# EAGLE design arduino_mini_can_bus (EAGLE 7.5.0)
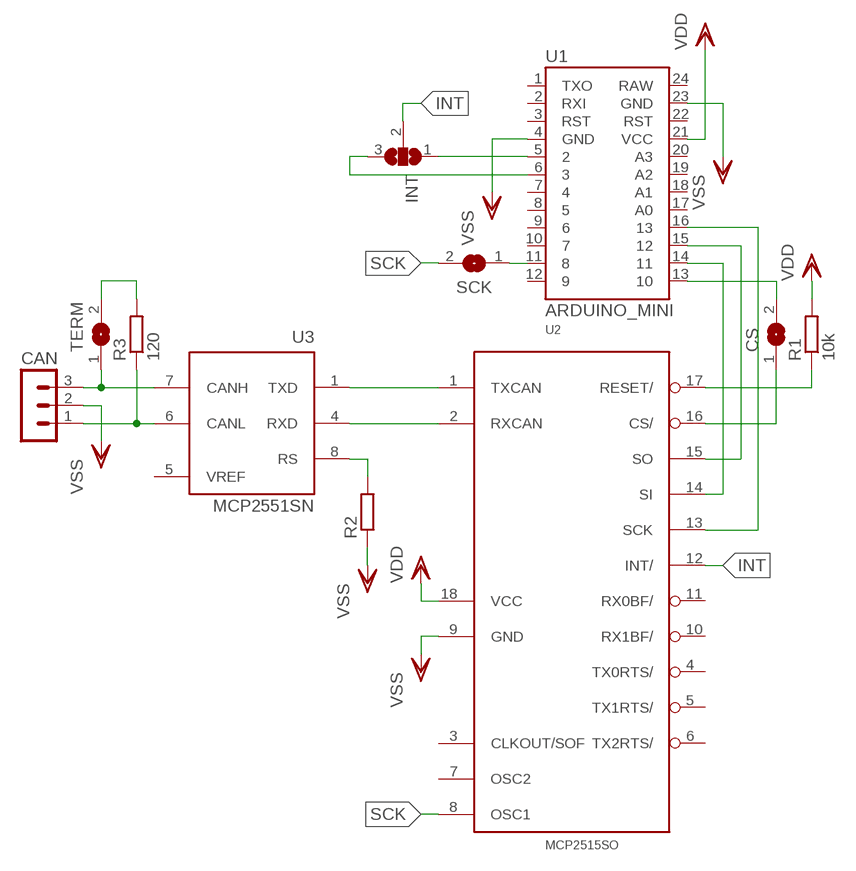
[diagram p0: schematic, sheet 1]

## Parts
CAN  MA03-1  [MA03-1]
CS  SJ  [SJ]
INT  SJ2W  [SJ_2]
R1  10k  R-EU_0207/10  [0207/10]
R2  R-EU_0207/10  [0207/10]
R3  120  R-EU_0207/10  [0207/10]
SCK  SJ  [SJ]
TERM  SJ  [SJ]
U1  ARDUINO_MINI  [ARDUINO_MINI]
U2  MCP2515SO  [SO18L]
U3  MCP2551SN  [SO-08]

## Nets
INT: INT.2 U2.12(INT/)
N$1: U1.14 U2.14(SI)
N$2: U1.15 U2.15(SO)
N$3: U1.16 U2.13(SCK)
N$4: CS.1 U2.16(CS/)
N$5: CS.2 U1.13
N$6: U2.1(TXCAN) U3.1(TXD)
N$7: U2.2(RXCAN) U3.4(RXD)
N$8: CAN.1 R3.1 U3.6(CANL)
N$9: CAN.3 TERM.1 U3.7(CANH)
N$10: SCK.1 U1.11
N$11: INT.1 U1.5
N$12: R3.2 TERM.2
N$13: R1.1 U2.17(RESET/)
N$14: R2.2 U3.8(RS)
N$15: INT.3 U1.6
SCK: SCK.2 U2.8(OSC1)
VDD: R1.2 U1.21(VCC) U2.18(VCC)
VSS: CAN.2 R2.1 U1.4(GND) U1.23(GND) U2.9(GND)
Unconnected: U1.1(TXO) U1.2(RXI) U1.3(RST) U1.7 U1.8 U1.9 U1.10 U1.12 U1.17(A0) U1.18(A1) U1.19(A2) U1.20(A3) U1.22(RST) U1.24(RAW) U2.3(CLKOUT/SOF) U2.4(TX0RTS/) U2.5(TX1RTS/) U2.6(TX2RTS/) U2.7(OSC2) U2.10(RX1BF/) U2.11(RX0BF/)

## Power pins joined to a net without a drawn wire
VDD: U3.3(VDD)
VREF: U3.5(VREF)
VSS: U3.2(VSS)

## Library data of the parts
CAN = con-lstb:MA03-1: PIN HEADER; OC_FARNELL: unknown; OC_NEWARK: unknown
CS SCK TERM = jumper:SJ: SMD solder JUMPER
INT = jumper:SJ2W: SMD solder JUMPER
R1-R3 = rcl:R-EU_: RESISTOR, European symbol
U1 = SparkFun-Boards:ARDUINO_MINI: Arduino Pro Mini footprint
U2 = MCP2515_MT:MCP2515*: MCP2515 Standalone CAN-Controller by Microchip Eagle-Lib. by MartinThomas
U3 = microchip_can:MCP2551: High Speed CAN tranceiver

## Board
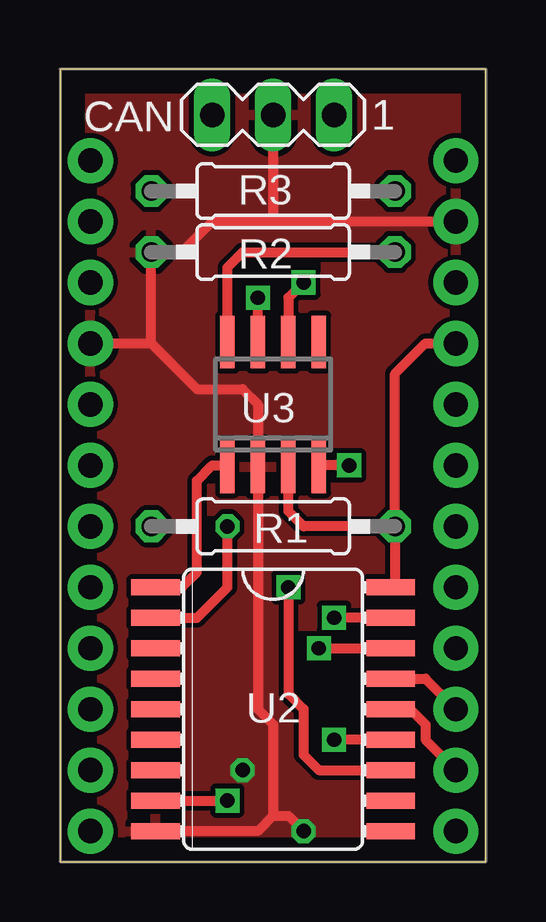
[diagram p1: board, top side]
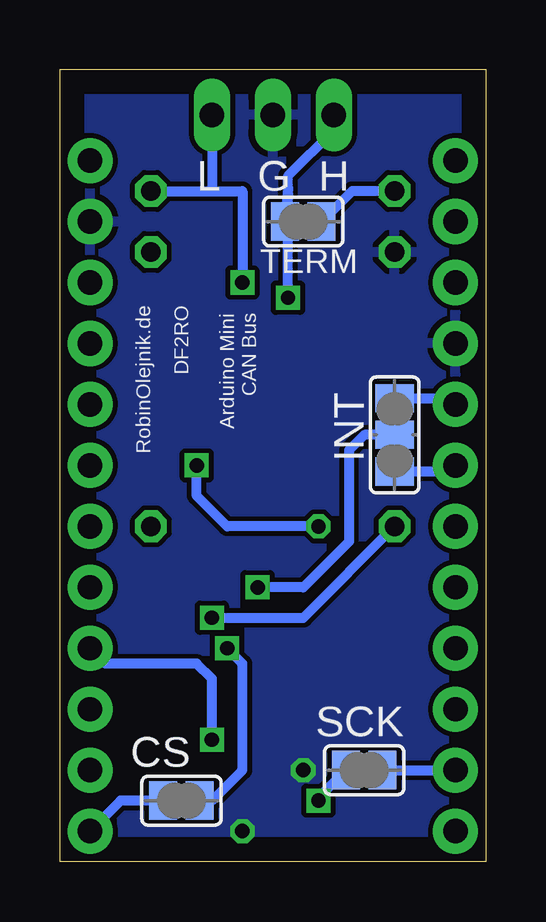
[diagram p2: board, bottom side, seen from below]

Size 17.77 x 33.01 mm. Coordinates in mm from the lower left corner, seen from the top.
Outline: 0,0 17.77,0 17.77,33.01 0,33.01 0,0
Copper layers (1*16): Top 0.035mm / dielectric 1.5mm / Bottom 0.035mm
Design rules "default": minimum track width 10mil, minimum drill 24mil, track to track 8mil, track to pad 8mil, pad to pad 8mil, via to via 8mil, smd to smd 8mil, copper to edge 40mil, drill to drill 8mil, minimum pad ring 10mil, minimum via ring 8mil, stop-mask expansion 4mil, vias tented up to drill 0mil, thermal gap 10mil

### Footprints (pad centres in the part's own frame; a part is rotated, then mirrored left to right if it is on the bottom)
MA03-1 = drill 1.016 long: 1 -2.54,0; 2 0,0; 3 2.54,0
SJ = smd 1.168 x 1.6: 1 -0.762,0; 2 0.762,0
SJ_2 = smd 1.168 x 1.6: 1 -1.524,0; 2 0,0; 3 1.524,0
0207/10 = drill 0.813 octagon: 1 -5.08,0; 2 5.08,0
ARDUINO_MINI = drill 1.016 pad 1.88: 1 -7.62,12.7; 2 -7.62,10.16; 3 -7.62,7.62; 4 -7.62,5.08; 5 -7.62,2.54; 6 -7.62,0; 7 -7.62,-2.54; 8 -7.62,-5.08; 9 -7.62,-7.62; 10 -7.62,-10.16; 11 -7.62,-12.7; 12 -7.62,-15.24; 13 7.62,-15.24; 14 7.62,-12.7; 15 7.62,-10.16; 16 7.62,-7.62; 17 7.62,-5.08; 18 7.62,-2.54; 19 7.62,0; 20 7.62,2.54; 21 7.62,5.08; 22 7.62,7.62; 23 7.62,10.16; 24 7.62,12.7
SO18L = smd 0.66 x 2.032: 1 -5.08,-4.902; 2 -3.81,-4.902; 3 -2.54,-4.902; 4 -1.27,-4.902; 5 0,-4.902; 6 1.27,-4.902; 7 2.54,-4.902; 8 3.81,-4.902; 9 5.08,-4.902; 10 5.08,4.902; 11 3.81,4.902; 12 2.54,4.902; 13 1.27,4.902; 14 0,4.902; 15 -1.27,4.902; 16 -2.54,4.902; 17 -3.81,4.902; 18 -5.08,4.902
SO-08 = smd 0.6 x 2.2: 1 -1.905,-2.6; 2 -0.635,-2.6; 3 0.635,-2.6; 4 1.905,-2.6; 5 1.905,2.6; 6 0.635,2.6; 7 -0.635,2.6; 8 -1.905,2.6

### Placement (x,y rotation side)
CAN  8.89,31.12 180 top
CS  12.7,2.54 180 bottom
INT  3.81,17.78 270 bottom
R1  8.89,13.97 0 top
R2  8.89,25.4 0 top
R3  8.89,27.94 180 top
SCK  5.08,3.81 180 bottom
TERM  7.62,26.67 0 bottom
U1  8.89,16.51 0 top
U2  8.89,6.35 270 top
U3  8.89,19.05 0 top

### Tracks (layer width: path | path; a pad name or v marks a point on that pad's centre or on a via)
INT  (via drill 0.6)
  Top 0.406: v9.52,11.43 9.52,6.98 10.16,6.35 10.16,4.45 10.79,3.81 U2.12
  Bottom 0.406: INT.2 5.08,17.78 5.71,17.15 5.71,13.34 7.62,11.43 v9.52,11.43
N$1
  Top 0.406: U2.14 14.6,6.35 15.24,5.71 15.24,5.08 U1.14
N$2
  Top 0.406: U2.15 15.24,7.62 U1.15
N$3  (via drill 0.6)
  Top 0.406: U2.13 v11.43,5.08
  Bottom 0.406: v11.43,5.08 11.43,7.62 12.06,8.25 15.88,8.25 U1.16
N$4  (via drill 0.6)
  Top 0.406: v10.79,8.89 U2.16
  Bottom 0.406: CS.1 11.43,2.54 10.16,3.81 10.16,8.25 v10.79,8.89
N$5
  Bottom 0.406: CS.2 15.24,2.54 U1.13
N$6
  Top 0.406: U2.1 5.08,11.43 5.71,12.06 5.71,15.88 6.35,16.51 6.93,16.51 U3.1
N$7  (via drill 0.6)
  Top 0.406: U2.2 5.71,10.16 6.98,11.43 v6.98,13.97 | v12.06,16.51 10.86,16.51 U3.4
  Bottom 0.406: v12.06,16.51 12.06,15.24 10.79,13.97 v6.98,13.97
N$8  (via drill 0.6)
  Top 0.406: v10.16,24.13 9.52,23.49 U3.6
  Bottom 0.406: R3.1 11.43,27.94 | 11.43,27.94 10.16,27.94 v10.16,24.13 | CAN.1 11.43,27.94
N$9  (via drill 0.6)
  Top 0.406: U3.7 v8.25,23.49
  Bottom 0.406: v8.25,23.49 8.25,27.81 TERM.1 8.25,28.07 8.25,28.58 6.35,30.48 CAN.3
N$10
  Bottom 0.406: SCK.1 U1.11
N$11
  Bottom 0.406: INT.1 1.52,19.3 U1.5
N$12
  Bottom 0.406: R3.2 5.59,27.94 TERM.2
N$13  (via drill 0.6)
  Top 0.406: U2.17 v11.43,10.16
  Bottom 0.406: v11.43,10.16 7.62,10.16 R1.1
N$14
  Top 0.406: U3.8 6.98,24.77 7.62,25.4 R2.2
N$15
  Bottom 0.406: INT.3 1.52,16.26 U1.6
SCK  (via drill 0.6)
  Top 0.406: U2.8 v6.98,2.54
  Bottom 0.406: v6.98,2.54 6.98,2.67 SCK.2
VDD
  Top 0.406: R1.2 13.97,11.61 U2.18 | R1.2 10.16,13.97 9.52,14.61 U3.3 | R1.2 13.97,20.32 15.24,21.59 U1.21
VSS  (via drill 0.6)
  Top 0.406: 3.81,21.59 R2.1 5.08,25.4 6.35,26.67 8.89,26.67 | U1.23 8.89,26.67 | CAN.2 8.89,26.67 | 3.81,21.59 5.71,19.69 7.62,19.69 8.25,19.05 U3.2 8.25,6.35 8.89,5.71 8.89,1.91 | U1.4 3.81,21.59 | 8.89,1.91 8.25,1.27 U2.9 | 8.89,1.91 9.52,1.91 v10.16,1.27
  other vias: 7.62,3.81
  pour Bottom: 0,33.02 0,0 17.78,0 17.78,33.02
  pour Top: 0,33.02 17.78,33.02 17.78,0 0,0

### Text on the board
bNames: H | G | L | Arduino Mini / CAN Bus | DF2RO | RobinOlejnik.de